# EAGLE design 01 (EAGLE 8.0.0)
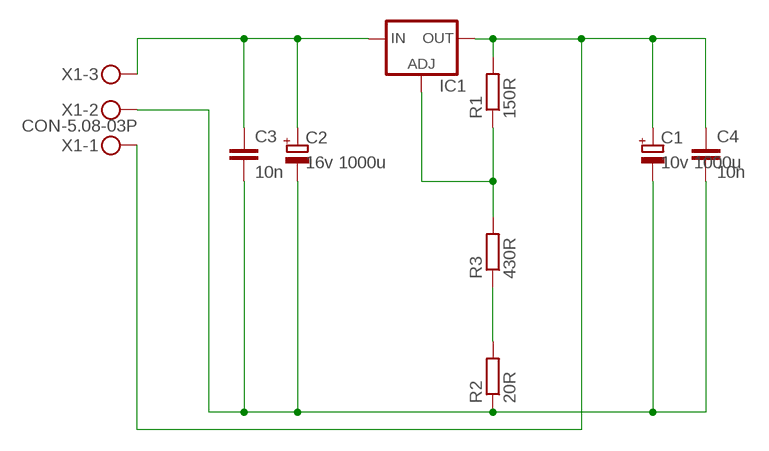
[diagram p0: schematic, sheet 1]

## Parts
C1  10v 1000u  CAP-POL_E5-10.5  [E5-10,5]
C2  16v 1000u  CAP-POL_E5-10.5  [E5-10,5]
C3  10n  CAP_1206  [C1206]
C4  10n  CAP_1206  [C1206]
IC1  LM350T  [317TS]
R1  150R  R_1206  [R1206]
R2  20R  R_1206  [R1206]
R3  430R  R_0805  [R0805]
X1  CON-5.08-03P  [MKDSN1,5/3-5,08]

## Nets
N$1: R2.2 R3.1
N$2: IC1.1(ADJ) R1.1 R3.2
N$3: C1.+ C4.1 IC1.2(OUT) R1.2 X1.1
N$4: C1.- C2.- C3.2 C4.2 R2.1 X1.2
N$5: C2.+ C3.1 IC1.3(IN) X1.3

## Library data of the parts
C1 C2 = Namenlos:CAP-POL_
C3 C4 = Namenlos:CAP_
IC1 = Namenlos:LM350T: VOLTAGE REGULATOR
R1-R3 = Namenlos:R_
X1 = Namenlos:CON-5.08-03P: MKDSN 1,5/ 3-5,08 Printklemme Nennstrom: 13,5 A Nennspannung: 250 V Rastermaß: 5,08 mm Polzahl: 3 Anschlussart: Schraubanschluss Montage: Löten Anschlussrichtung Leiter/Platine: 0 ° Artikelnummer: 1729131 Source: http://eshop.phoenixcontact.com .. 1729131.pdf

## Board
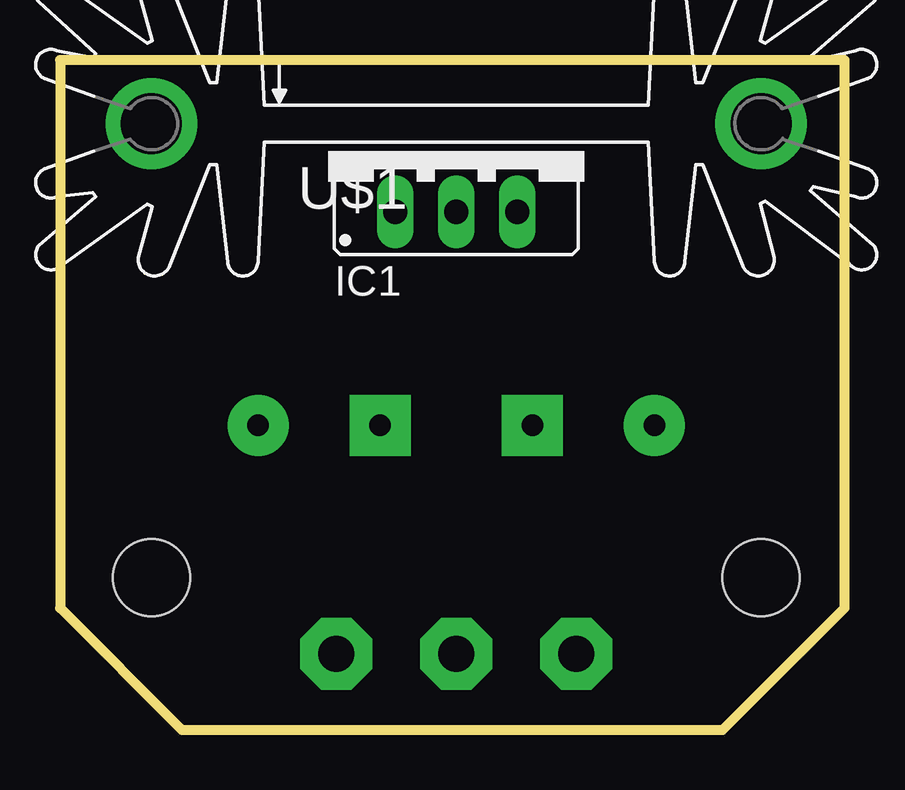
[diagram p1: board, top side]
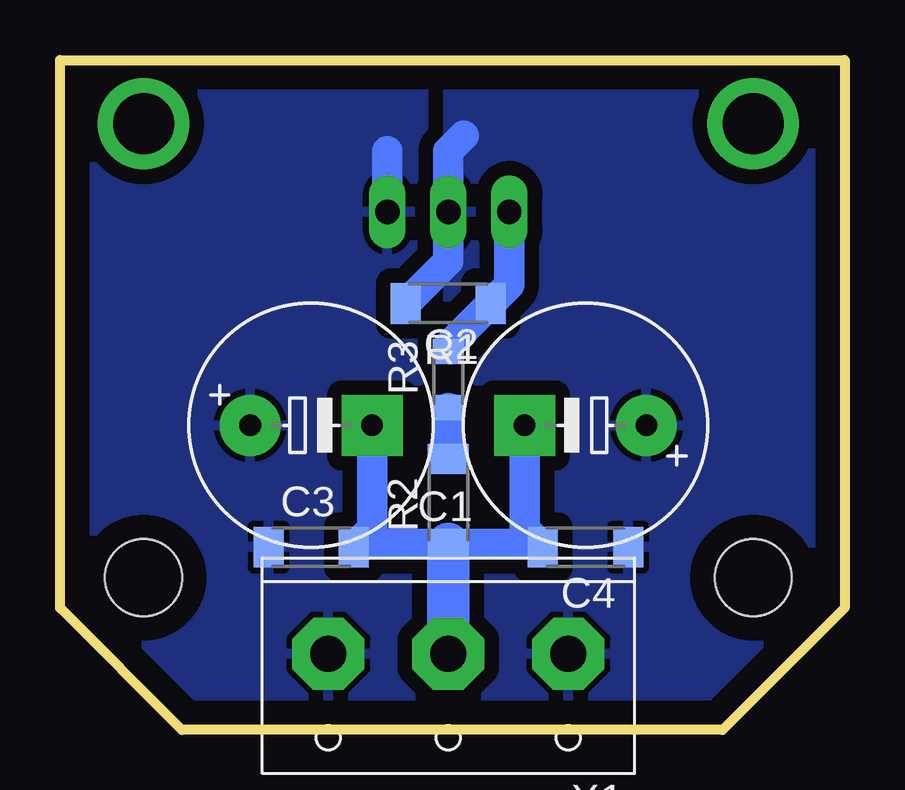
[diagram p2: board, bottom side, seen from below]

Size 32.69 x 27.93 mm. Coordinates in mm from the lower left corner, seen from the top.
Outline: 0,27.93 0,5.08 5.08,0 27.61,0 32.69,5.08 32.69,27.93 0,27.93
Copper layers (1*16): Top 0.035mm / dielectric 1.5mm / Bottom 0.035mm
Design rules "default": minimum track width 10mil, minimum drill 24mil, track to track 8mil, track to pad 8mil, pad to pad 8mil, via to via 8mil, smd to smd 8mil, copper to edge 40mil, drill to drill 8mil, minimum pad ring 10mil, minimum via ring 8mil, stop-mask expansion 4mil, vias tented up to drill 0mil, thermal gap 10mil
Holes 3.2 mm at 3.81,6.35 29.21,6.35

### Footprints (pad centres in the part's own frame; a part is rotated, then mirrored left to right if it is on the bottom)
E5-10,5 = drill 0.9 pad 2.54: + -2.54,0 | drill 0.9 pad 2.54 square: - 2.54,0
C1206 = smd 1.25 x 1.7: 1 -1.775,0; 2 1.775,0
317TS = drill 1.016 long: 1 -2.54,-2.54; 2 0,-2.54; 3 2.54,-2.54
R1206 = smd 1.25 x 1.7: 1 -1.775,0; 2 1.775,0
R0805 = smd 1.05 x 1.3: 1 -1.175,0; 2 1.175,0
SK104-PAD = drill 2.54 pad 3.81: K1 -12.7,-0.762; K2 12.7,-0.762
MKDSN1,5/3-5,08 = drill 1.5 pad 3 octagon: 1 -5,0; 2 0,0; 3 5,0

### Placement (x,y rotation side)
C1  10.79,12.7 180 bottom
C2  22.23,12.7 0 bottom
C3  22.23,7.62 0 bottom
C4  10.79,7.62 180 bottom
IC1  16.51,24.13 0 top
R1  16.51,17.78 180 bottom
R2  16.51,9.52 90 bottom
R3  16.51,14.6 90 bottom
U$1  [SK104-PAD]  16.51,26.03 0 top
X1  16.51,3.17 180 bottom

### Tracks (layer width: path | path; a pad name or v marks a point on that pad's centre or on a via)
N$1
  Bottom 1.27: R3.1 R2.2
N$2
  Bottom 0.813: R3.2 16.51,16
  Bottom 1.27: IC1.1 13.97,18.55 R1.1 16.51,16
N$3
  Bottom 1.27: R1.2 16.51,19.55 IC1.2 16.51,24.13 15.87,24.77
  pour Bottom (isolate 0.61): 16.51,0 16.51,27.94 0,27.94 0,5.08 5.08,0
N$4
  Bottom 1.27: 13.84,12.2 C1.- 13.33,8.38 C4.2 12.7,7.75 R2.1 20.32,7.75 C3.2 19.69,8.38 C2.- 19.18,12.2
  Bottom 1.778: X1.2 R2.1
N$5
  Bottom 1.27: 19.05,24.13 IC1.3
  pour Bottom (isolate 0.61, rank 2): 16.51,0 16.51,27.94 33.02,27.94 33.02,5.08 27.94,0